# Altium schematic sheet SWReg.SchDoc
size A3; SheetNumber: 4; SheetTotal: 4
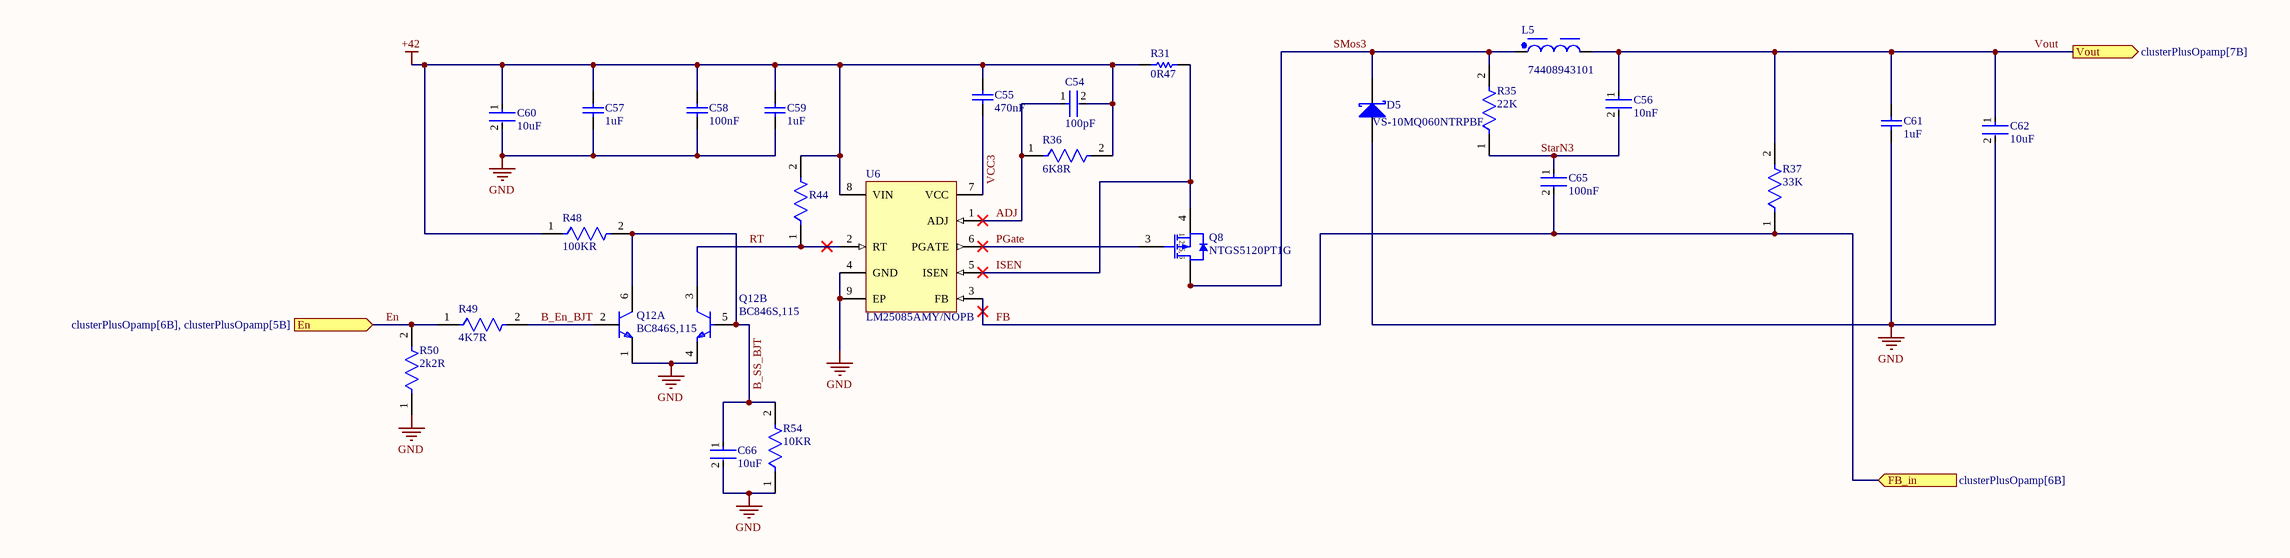
[diagram p0: SWReg.SchDoc]

## Parts
C54  100pF  [FP-C0402-BB-MFG]
C55  470nF  [CAPC1608X90X35LL15T15]
C56  10nF  [FP-CC1206-1_25-MFG]
C57  1uF  [CAPC1608X90X35LL15T15]
C58  100nF  [CAPC1608X90X35LL15T15]
C59  1uF  [CAPC1608X90X35LL15T15]
C60  10uF  [FP-CC1206-1_25-MFG]
C61  1uF  [CAPC2013X140X50LL20T25]
C62  10uF  [FP-GRM31C-0_2-e0_3_0_8-MFG]
C65  100nF  [FP-CC1206-1_25-MFG]
C66  10uF  [FP-CC1206-1_25-MFG]
D5  VS-10MQ060NTRPBF  [VISH-DO-214AC_V]
L5  74408943101  [WE-SPC_4838]
Q8  NTGS5120PT1G  [ONSC-TSOP-6-318G-02_V]
Q12  BC846S,115  [FP-SOT363-MFG]  (parts A,B of 2)
R31  0R47  [RESC3216X70X50NL05T20]
R35  22K  [FP-RC0402-0_4-MFG]
R36  6K8R  [FP-RC0402-0_4-MFG]
R37  33K  [FP-RC0603-0_55-MFG]
R44  240K  [FP-CRCW0603-e3-MFG]  (value not drawn)
R48  100KR  [FP-RC0402-0_4-MFG]
R49  4K7R  [FP-RC0402-0_4-MFG]
R50  2k2R  [FP-RC0402-0_4-MFG]
R54  10KR  [FP-RC0402-0_4-MFG]
U6  LM25085AMY/NOPB  [DGN0008A_M]

## Ports
En (in, see clusterPlusOpamp[6B], clusterPlusOpamp[5B]), FB_in (in, see clusterPlusOpamp[6B]), Vout (out, see clusterPlusOpamp[7B])

## Nets
+42: C54.2 C55.2 C57.2 C58.2 C59.2 C60.1 R31.1 R36.2 R44.2 R48.1 U6.8(VIN)
GND: C57.1 C58.1 C59.1 C60.2 C61.1 C62.2 C66.2 D5.1(A) Q12.1(E) Q12.4(E) R50.1 R54.1 U6.4(GND) U6.9(EP)
ADJ: C54.1 R36.1 U6.1(ADJ)
B_En_BJT: Q12.2(B) R49.2
B_SS_BJT: C66.1 Q12.5(B) Q12.6(C) R48.2 R54.2
En: R49.1 R50.2 ; port En
FB: C65.2 R37.1 U6.3(FB) ; port FB_in
ISEN: Q8.4(S) R31.2 U6.5(ISEN)
PGate: Q8.3(G) U6.6(PGATE)
RT: Q12.3(C) R44.1 U6.2(RT)
SMos3: D5.2(K) L5.1 Q8.1(D) Q8.2(D) Q8.5(D) Q8.6(D) R35.2
StarN3: C56.2 C65.1 R35.1
VCC3: C55.1 U6.7(VCC)
Vout: C56.1 C61.2 C62.1 L5.2 R37.2 ; port Vout

## Notes on the sheet
- (in symbol CMP-1058-00979-1) 1, 2, 5, 6

## Library data of the parts
C54 = CMP-1034-00716-4: CAP CER 10PF 25V 5% NP0 0402; Manufacturer Part Number: C0402C100J3GACTU; Manufacturer: Kemet; Temperature Characteristic: C0G; Material: Ceramic; Temperature Coefficient: 15%; Tolerance: 0.05; Octopart: https://octopart.com/c0402c100j3gactu-kemet-9138549; Lead Free: Yes; Automotive: No; Value: 10 pF; Voltage Rating: 25 V; RoHS: TRUE; Device Class L2: Capacitors; Capacitance: 10 pF; Category: Cap; Temperature Range High: +125°C; ComponentLink2URL: https://content.kemet.com/datasheets/KEM_C1002_X7R_SMD.pdf; Temperature: -55°C to +125°C; Temperature Range Low: -55°C; Device Class L3: Ceramic Capacitors; Device Class L1: Passive Components; Mouser Description: Multilayer Ceramic Capacitors MLCC - SMD/SMT 25volts 10pF C0G 5%; ComponentLink2Description: Datasheet; Package: C0402-BB; Height: 0.55mm; Ipc Land Pattern Name: CAPC10050X50; Digikey Description: CAP CER 10PF 25V 5% NP0 0402
C55 C57-C59 = CMP-2006-02298-2: Manufacturer: Kemet; Part Number: C0603C105K4RACTU
C56 C60 C66 = CMP-03422-000842-1: CAP CER 0.1UF 50V X7R 1206; Manufacturer: Yageo; Manufacturer Part Number: CC1206KRX7R9BB104; Automotive Grade: NA; Value: 100 nF; Tolerance: 0.1; Material: Ceramic; Temperature Coefficient: 15%; Temperature Characteristic: X7R; Device Class L1: Passive Components; Lead Free: Yes; Octopart: https://octopart.com/cc1206krx7r9bb104-yageo-39467816; Category: Cap; Temperature Range Low: -55°C; Device Class L3: Ceramic Capacitors; Voltage Rating: 50 V; Temperature Range High: +125°C; Device Class L2: Capacitors; RoHS: TRUE; Package: CC1206-1.25; Footprint Url: http://www.yageo.com/exep/pages/download/literatures/UPY-C_GEN_24.pdf; ComponentLink2Description: Datasheet; Temperature: -55°C to +125°C; Capacitance: 100 nF; Digikey Description: CAP CER 0.1UF 50V X7R 1206; Height: 1.45mm; Automotive: No; Mouser Description: Multilayer Ceramic Capacitors MLCC - SMD/SMT 100nF 50V X7R 10%; ComponentLink2URL: http://www.yageo.com/documents/recent/UPY-NP0X7R_HV_1KV-to-3KV_11.pdf
C61 = CMP-2007-03234-1: Part Number: C0805C105K3RACTU; Manufacturer: Kemet
C62 = CMP-06035-003589-1: Chip Multilayer Ceramic Capacitors for General Purpose, 1206, 10uF, X7R, 15%, 10%, 25V; Case Code (Imperial): 1206; Voltage Rating (DC): 25V; Voltage Rating: 25V; Length: 3.2mm; Lead Free: Lead Free; Thickness: 0.071inch; Package Quantity: 1; Width: 1.6mm; Max Operating Temperature: 125°C; Number of Pins: 2; Height: 1.6mm; Case Code (Metric): 3216; REACH SVHC: No SVHC; Radiation Hardening: No; Case/Package: 1206; Material: Ceramic; Tolerance: 10%; Voltage: 25V; Mount: Surface Mount; Packaging: Tape and Reel; Dielectric: X7R; Termination: SMD/SMT; Min Operating Temperature: -55°C; Capacitance: 10uF; Depth: 1.6mm
C65 = CMP-03422-000842-1: CAP CER 0.1UF 50V X7R 1206; Manufacturer: Yageo; Manufacturer Part Number: CC1206KRX7R9BB104; Automotive Grade: NA; Tolerance: 0.1; Material: Ceramic; Temperature Coefficient: 15%; Temperature Characteristic: X7R; Device Class L1: Passive Components; Lead Free: Yes; Octopart: https://octopart.com/cc1206krx7r9bb104-yageo-39467816; Category: Cap; Value: 100 nF; Temperature Range Low: -55°C; Device Class L3: Ceramic Capacitors; Voltage Rating: 50 V; Temperature Range High: +125°C; Device Class L2: Capacitors; RoHS: TRUE; Package: CC1206-1.25; Footprint Url: http://www.yageo.com/exep/pages/download/literatures/UPY-C_GEN_24.pdf; ComponentLink2Description: Datasheet; Temperature: -55°C to +125°C; Capacitance: 100 nF; Digikey Description: CAP CER 0.1UF 50V X7R 1206; Height: 1.45mm; Automotive: No; Mouser Description: Multilayer Ceramic Capacitors MLCC - SMD/SMT 100nF 50V X7R 10%; ComponentLink2URL: http://www.yageo.com/documents/recent/UPY-NP0X7R_HV_1KV-to-3KV_11.pdf
D5 = CMP-2000-07404-1: High Performance Schottky Rectifier, 60 V, 1 A, -55 to 150 degC, 2-Pin DO-214AC (SMA), RoHS, Tape and Reel; Manufacturer: Vishay; Current - Reverse Leakage @ Vr: 500µA@60V; Current - Average Rectified (Io): 2.1A; Speed: FastRecovery= / 200mA(Io); Voltage - Forward (Vf) (Max) @ If: 710mV@1.5A; Thermal Resistance: 80°C/WJa; Voltage - DC Reverse (Vr) (Max): 60V; Catalog Drawings: SMASeriesTop / SMASeriesSide; Other Names: 10MQ060NPBFTR / 10MQ060NTRPBF / VS-10MQ060NPBFTR / VS-10MQ060NPBFTR-ND / VS10MQ060NPBFTR-ND / VS10MQ060NTRPBF; Dynamic Catalog: SchottkyDiode; Mounting Type: SurfaceMount; Supplier Device Package: DO-214AC(SMA); Package / Case: DO-214AC,SMA; Mounting Technology: SurfaceMount; Datasheet URL: http://www.vishay.com/docs/94118/vs-10mq060npbf.pdf; Category: DiscreteSemiconductorProducts; Family: Diodes,Rectifiers-Single; Datasheet Version: 02/2015; Package Description: 2-Pin Surface Mount Device, Body 4.245 x 2.665 mm; Quantity Available: Tape&Reel(TR)AlternatePackaging; Junction Operating Temp: -55°C~150°C; Manufacturer URL: http://www.vishay.com/; Diode Type: Schottky; Package Reference: DO-214AC (SMA); Packaging: Tape&Reel(TR); Minimum Quantity: Schottky; Operating Temperature - Junction: -55°C~150°C; Standard Package: 7,500
L5 = CMP-1418-00004-2: NexarPartId: 22866605; Self Resonant Frequency: 7.8MHz; Current Rating: 520mA; Tolerance: 20%; Shielding: Shielded; Core Material: Ferrite; Test Frequency: 100kHz; Saturation Current: 680mA; Inductance: 100µH; DC Resistance (DCR): 770mΩ; Depth: 4.8mm; RMS Current (Irms): 520mA; Length: 4.8mm; REACH SVHC: Unknown; Height: 3.8mm; Height - Seated (Max): 4.0894mm; Min Operating Temperature: -40°C; Case/Package: Nonstandard; Composition: Wirewound; Width: 4.8mm; Packaging: Cut Tape (CT); Number of Pins: 2; Termination: SMD/SMT; RoHS: Compliant; Lead Free: Lead Free; Max DC Current: 520mA; Max Operating Temperature: 125°C; Inductance Tolerance: 20%; Ambient Temperature Range High: 85°C; Ambient Temperature Range Low: -40°C; Mount: Surface Mount
Q8 = CMP-1058-00979-1: Power MOSFET, -60 V, -2.9 A, Single P-Channel, 6-Pin TSOP, Pb-Free, Tape and Reel; Manufacturer: On Semiconductor; Channel Polarity: P Channel; ID Max (A): 2.9; VGS(th) Max (V): 3; VGS Max (V): 20; Ciss Typ (pF): 942; V(BR)DSS Min (V): 60; Qrr Typ (nC): 15.1; Coss Typ (pF): 72; Crss Typ (pF): 48; Packing: Tape and Reel; DatasheetVersion: Rev. P0; RoHS: Pb-Free; PackageDescription: 6-Pin Small Outline Package, Body 3 x 1.5 mm, Pitch 0.95 mm; Mounting Technology: Surface Mount; PackageVersion: Rev. V, 06/2012; Configuration: Single; ComponentLink1Description: Manufacturer URL; PartNumber: NTGS5120PT1G; PackageReference: TSOP-6-318G-02; ComponentLink2URL: http://www.onsemi.com/pub_link/Collateral/NTGS5120P-D.PDF; ComponentLink2Description: Datasheet; ComponentLink3URL: http://www.onsemi.com/pub_link/Collateral/318G-02.PDF; ComponentLink1URL: http://www.onsemi.com/; Package Type: TSOP-6; ComponentLink3Description: Package Specification
Q12 = CMP-14406-000015-1: TRANS 2NPN 65V 0.1A 6TSSOP; Manufacturer: Nexperia; Collector Emitter Saturation Voltage: 300mV; Hfe Testvce: 5V; Max Collector Current: 100mA; Automotive Grade: Grade 0; Hfe Testic: 2mA; Hfe Min: 110; Collector Base Voltage: 80V; Max Junction Temp: +150°C; Rthja Max: 416K/W; Emitter Base Voltage: 6V; Number Of Elements: 2; Unity Gain Freq: 100MHz; Power Dissipation: 300mW; Device Class L2: Transistors; Lead Free: Yes; Height: 1.1mm; ComponentLink2URL: https://assets.nexperia.com/documents/data-sheet/BC846S.pdf; Temperature: to +150°C; Ambient Temperature Range Low: -65°C; Collector Emitter Voltage: 65V; Temperature Range High: +150°C; Category: Trans; Automotive: Yes; Octopart: https://octopart.com/bc846s%2C115-nexperia-78739099; Digikey Description: TRANS 2NPN 65V 0.1A 6TSSOP; Ambient Temperature Range High: +150°C; Footprint Url: https://assets.nexperia.com/documents/outline-drawing/SOT363.pdf; Device Class L3: BJTs; Device Class L1: Discrete Semiconductors; Package: SOT363; RoHS: TRUE; Manufacturer Part Number: BC846S,115; Number Of Npn: 2; ComponentLink2Description: Datasheet
R31 = CMP-2003-00782-1: Part Number: ERJ8BWFR068V; Manufacturer: Panasonic
R35 R36 R48-R50 R54 = CMP-2002-08011-2: Tolerance: 5%; Power Rating: 63mW; Resistance: 4.7kΩ; Voltage Rating: 50V; Temperature Coefficient: 100ppm/°C; Composition: Thick Film; Max Operating Temperature: 155°C; Case/Package: 0402; Depth: 500µm; Packaging: Tape & Reel; Number of Pins: 2; Schedule B: 8533210045, 8533210045; Case Code (Imperial): 0402; Termination: SMD/SMT; Military Standard: Not; Lead Free: Lead Free; Width: 500µm; REACH SVHC: No SVHC; Max Power Dissipation: 63mW; Voltage Rating (AC): 50V; Features: Moisture Resistant; Min Operating Temperature: -55°C; Number of Terminations: 2; RoHS: Compliant; Height: 350µm; Voltage Rating (DC): 50V; Length: 1mm
R37 = CMP-2100-03662-2: RES SMD 100K OHM 1% 1/10W 0603; Voltage Rating (DC): 50V; Resistance: 100kR; Max Power Dissipation: 100mW; Temperature Coefficient: 100ppm/°C; Working Voltage: 75V; Length: 1.6mm; Lead Free: Lead Free; Number of Terminations: 2; Packaging: Tape and Reel; Voltage Rating: 50V; Termination: SMD/SMT; Width: 0.8mm; Resistor Type: Thick Film; Resistance Tolerance: 1%; Features: Moisture Resistant; Height: 0.45mm; Construction: Rectangular; Case/Package: 0603; Military Standard: Not; Case Code (Imperial): 0603; Series: RC; Technology: THICK FILM; Depth: 0.8mm; RoHS Compliant: Yes; REACH SVHC: No SVHC; Min Operating Temperature: -55°C; Case Code (Metric): 1608; Max Operating Temperature: 155°C; Power Rating: 100mW; Number of Pins: 2; Tolerance: 1%
R44 = CMP-1012-00717-3: RES Thick Film, 68kΩ, 1%, 0.1W, 100ppm/°C, 0603; Max Power Dissipation: 100mW; Resistance: 68kR; Voltage Rating (DC): 75V; Case Code (Metric): 1608; Termination: SMD/SMT; Tolerance: 1%; Case Code (Imperial): 0603; Radiation Hardening: No; Composition: Thick Film; Max Operating Temperature: 155°C; Features: Automotive AEC-Q200; Military Standard: Not; Contact Plating: Tin; Case/Package: 0603; Min Operating Temperature: -55°C; Power Rating: 100mW; Width: 0.033inch; Lead Free: Lead Free; Package Quantity: 10; Number of Terminations: 2; Mount: Surface Mount; Length: 1.55mm; Temperature Coefficient: 100ppm/°C; Packaging: Tape and Reel; Height: 0.45mm; Weight: 7.1E-05oz; Voltage Rating: 75V; Depth: 0.85mm; Number of Pins: 2
U6 = CMP-0063-01196-3: 42V Constant On-Time PFET Buck Switching Controller with 0.9V Reference, 8-pin eMSOP, Pb-Free; Manufacturer: Texas Instruments; CompType: MiscPower; PackageTopMarking: ZXTT*SVYA; PowerWise: N; PinCount: 8; ComponentLink1URL: http://www.ti.com/general/docs/lit/getliterature.tsp?genericPartNumber=LM25085A&fileType=pdf; RoHS: Y; Code_JEDEC: MO-187-AA; ComponentLink1Description: Datasheet URL; PackageDescription: Molded Mini-SO, Exposed Pad, .118 x .118 x .034in Body, 8 Lead, .0256in Pitch; PackageReference: DGN0008A